# Altium schematic sheet FT232BL_PWM.SchDoc
size A4
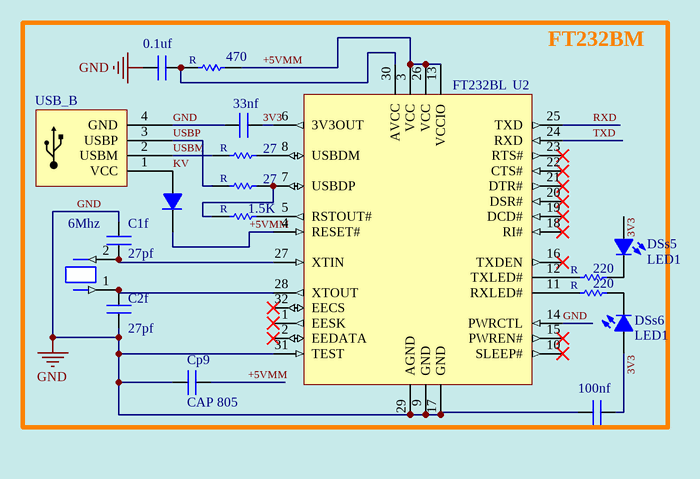
[diagram p0: FT232BL_PWM.SchDoc]

## Parts
6  1.5K  [R0805]
278D  470  [R0805]
C1f  27pf  [Cap0805]
C2f  27pf  [Cap0805]
C3f  0.1uf  [Cap0805]
C4AED  100nf  [Cap0805]
C6f  33nf  [Cap0805]
Cp9  CAP 805  [Cap0805]
D?e  1N4001  [Diod-1A-SMD]  (value not drawn)
DSs5  LED1  [Led0805]
DSs6  LED1  [Led0805]
RF5  27  [R0805]
RF6  27  [R0805]
RF7  220  [R0805]
RF8  220  [R0805]
U2  FT232BL  [LQFP-32_N]
USBE  USB_B  [USB_Dip_R]
Y2fD  6Mhz  [Crystal]

## Blocks framed on the sheet
FT232BM: 6 278D C1f C2f C3f C4AED C6f Cp9 D?e DSs5 DSs6 RF5-RF8 U2 USBE Y2fD

## Nets
GND: C1f.2 C2f.1 C3f.1 C4AED.2 C6f.1 Cp9.1 U2.9(GND) U2.14(PWRCTL) U2.17(GND) U2.29(AGND) U2.31(TEST) USBE.4(GND)
3V3: C4AED.1 C6f.2 DSs5.A DSs6.A U2.6(3V3OUT)
+5VMM: 278D.1 Cp9.2 D?e.K U2.3(VCC) U2.4(RESET#) U2.13(VCCIO) U2.26(VCC)
KV: D?e.A USBE.1(VCC)
RXD: U2.25(TXD)
TXD: U2.24(RXD)
USBM: RF5.2 USBE.2(USBM)
USBP: RF6.2 USBE.3(USBP)
Net6_1: 6.1 U2.5(RSTOUT#)
Net6_2: 6.2 RF6.1 U2.7(USBDP)
Net278D_2: 278D.2 C3f.2 U2.30(AVCC)
NetC1f_1: C1f.1 U2.27(XTIN) Y2fD.2
NetC2f_2: C2f.2 U2.28(XTOUT) Y2fD.1
NetDSs5_K: DSs5.K RF7.1
NetDSs6_K: DSs6.K RF8.1
NetRF5_1: RF5.1 U2.8(USBDM)
NetRF7_2: RF7.2 U2.12(TXLED#)
NetRF8_2: RF8.2 U2.11(RXLED#)

Not connected (* = marked no-connect by the designer): U2 1(EESK)* 2(EEDATA)* 10(SLEEP#)* 15(PWREN#)* 16(TXDEN)* 18(RI#)* 19(DCD#)* 20(DSR#)* 21(DTR#)* 22(CTS#)* 23(RTS#)* 32(EECS)*

## Notes on the sheet
- Title
- Size:
- Data:
- CompanyName:
- A4
- Number:
- Time:
- Revision:
- Engineer:
- File:
- (in symbol R0805) R

## Library data of the parts
6 278D RF5-RF8 = R0805
C1f C2f C3f C4AED C6f Cp9 = Cap0805: surface mount capacitor (size 805)
D?e = Diode
U2 = FT232BL: USB UART Asynchronous Serial Data Transfer Chip, 0 to +70 degC, 32-pin LQFP, Pb-Free; Manufacturer: FTDI; DatasheetVersion: ver 2.2, Nov-2011; PackageVersion: Nov-11; PackageReference: LQFP-32; PackageDescription: 32-Pin Thin Quad Flat Pack, 7 x 7 mm Body, 0.8 mm Pitch; PartNumber: FT232BL; ComponentLink1Description: Manufacturer URL; ComponentLink1URL: http://www.ftdichip.com/; ComponentLink2Description: Datasheet; ComponentLink2URL: http://www.ftdichip.com/Support/Documents/DataSheets/ICs/DS_FT232BL_BQ.pdf
Y2fD = Crystal